# Altium schematic sheet 01.SchDoc
size 246 x 182 mm
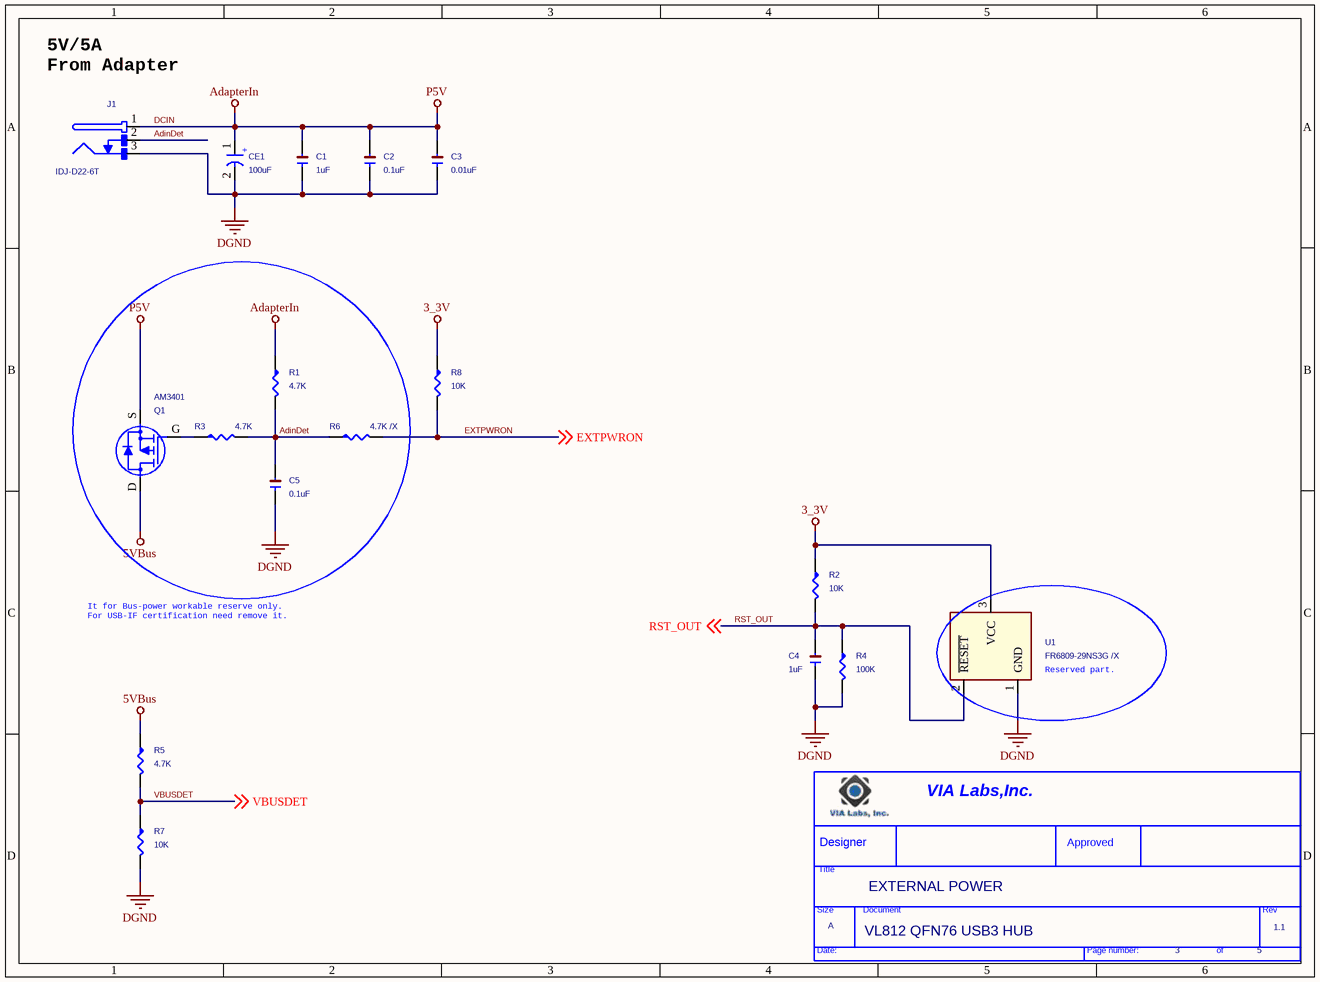
[diagram p0: 01.SchDoc]

## Parts
*  Page Count: 5  Page Number: 3  Page Size: A  Title: EXTERNAL POWER  RevCode: 1.1  Doc: VL812 QFN76 USB3 HUB  (hidden comment: TitleBlock0)  (graphical)
C1  1uF  [1206]
C2  0.1uF  [1206]
C3  0.01uF  [1206]
C4  1uF  [1206]
C5  0.1uF  [1206]
CE1  100uF  [EC5X7-80]
J1  IDJ-D22-6T  [DCJACK-IDJ-D22-6T]
Q1  AM3401  [sot23-gds]
R1  4.7K  [RES0402]
R2  10K  [RES0402]
R3  4.7K  [RES0402]
R4  100K  [RES0402]
R5  4.7K  [RES0402]
R6  4.7K /X  [RES0402]
R7  10K  [RES0402]
R8  10K  [RES0402]
U1  FR6809-29NS3G /X  [SOT23-132]

## Nets
3_3V: R2.1 R8.1 U1.3(VCC)
5VBus: Q1.D(DRAIN) R5.1
DCIN: C1.2 C2.2 C3.2 CE1.1(+) J1.1 Q1.S(SOURCE) R1.1  [also labelled AdapterIn, P5V]
DGND: C1.1 C2.1 C3.1 C4.1 C5.1 CE1.2(-) J1.3 R4.2 R7.2 U1.1(GND)
AdinDet: C5.2 J1.2 R1.2 R3.2 R6.1
EXTPWRON: R6.2 R8.2 ; off-sheet EXTPWRON
RST_OUT: C4.2 R2.2 R4.1 U1.2(~{RESET}) ; off-sheet RST_OUT
VBUSDET: R5.2 R7.1 ; off-sheet VBUSDET
NetQ1_G: Q1.G(GATE) R3.1

## Notes on the sheet
- (near J1) 5V/5A
  From Adapter
- It for Bus-power workable reserve only.
  For USB-IF certification need remove it.
- (near U1) Reserved part.
- (in symbol TitleBlock0) VIA Labs,Inc.; Designer; Approved; Title; Size; Document; Rev; Date:; Page number:; of

## Library data of the parts
C1 C4 = C: Part Number: 99G12-00009B; DSCX: CAP ML 1 uF Z 10V Y5V SMT0603,THICKNESS=0.80∮0.10mm C1608Y5V105ZDT DARFON; QUAN: 13000; Qualify: YES; Dsc8: DARFON; Dsc7: C1608Y5V105ZDT; Dsc6: SMT0603,THICKNESS=0.80∮0.10mm; Dsc5: Y5V; Dsc4: 10V; Dsc3: Z; Dsc1: CAP ML; approval status: A; 弧: CAP ML 1 uF Z 10V Y5V SMT0603,; ID: 17426; Date: 12302002; Cost: 0.00; Part Type: SMD CAP; Dsc2: 1 uF
C2 = C: Part Number: 99G12-006525; ID: 16,890; 弧: CAP ML0.1 uFZ16VY5VSMT0402,THICKNESS=0.50∮0.05mmCC; approval status: A; Dsc1: CAP ML; Dsc3: K; Dsc4: 16V; Dsc5: X5R; Dsc6: SMT0402,THICKNESS=0.50mm; Dsc7: EMK105BJ104KV; Dsc8: TAIYO; Qualify: YES; QUAN: 34,490; DSCX: CAP ML 0.1 uF K 16V X5R SMT0402,THICKNESS=0.50mm EMK105BJ104KV TAIYO; Date: 12302002; Dsc2: 0.1 uF; Part Type: SMD CAP; Cost: 0
C3 = C: Part Number: 99G12-005696; DSCX: CAP ML 0.01 uF Z 16V Y5V SMT0402,THICKNESS=0.50∮0.05mm CC0402ZRY5V7BB103 YAGEO; QUAN: 10000; Qualify: YES; Dsc8: YAGEO; Dsc7: CC0402ZRY5V7BB103; Dsc6: SMT0402,THICKNESS=0.50∮0.05mm; Dsc5: Y5V; Dsc4: 16V; Dsc3: Z; Dsc1: CAP ML; approval status: NA; 弧: CAP ML0.01 uFZ16VY5VSMT0402,THICKNESS=0.50∮0.05mmC; ID: 17869; Date: 12302002; Cost: 0.00; Part Type: SMD CAP; Dsc2: 0.01 uF
C5 = C: Part Number: 99G12-006525; QUAN: 34,490; Qualify: YES; Dsc8: TAIYO; Dsc7: EMK105BJ104KV; Dsc6: SMT0402,THICKNESS=0.50mm; Dsc5: X5R; Dsc4: 16V; Dsc3: K; Dsc1: CAP ML; approval status: A; 弧: CAP ML0.1 uFZ16VY5VSMT0402,THICKNESS=0.50∮0.05mmCC; ID: 16,890; DSCX: CAP ML 0.1 uF K 16V X5R SMT0402,THICKNESS=0.50mm EMK105BJ104KV TAIYO; Date: 12302002; Cost: 0; Part Type: SMD CAP; Dsc2: 0.1 uF
CE1 = CE: Part Number: 99G15-020132; ID: 18195; 弧: CAP EC 100 uF M 10V 105 DIP P; approval status: A; Dsc1: CAP EC; Dsc3: M; Dsc4: 10V; Dsc5: 105; Dsc6: DIP PIN 5*7*2mm,3.0~3.5mm; Dsc7: ECMI101M0100507EBC; Dsc8: GSC; Qualify: YES; Approval Sheet: \\tp_mi05\BackUp\VPSD\BillYang\VEPD\Data Sheet\99G\99G15-02\99G15-020132.pdf; QUAN: 3845; DSCX: CAP EC 100 uF M 10V 105 DIP PIN 5*7*2mm,3.0~3.5mm ECMI101M0100507EBC GSC; Date: 12302002; Dsc2: 100 uF; Part Type: DIP CAP EC; Cost: 0.01
J1 = DCJack-IDJ-D22-6T_0: Part Number: 99G30-110462; DSCX: CONN JACK DC JACK IDJ-D22-6T 3PIN BLACK 2.5mm DIP/RIGHT ANGLE 翬礨; QUAN: 0; Qualify: YES; Dsc8: 翬礨; Dsc7: DIP/RIGHT ANGLE; Dsc6: 2.5mm; Dsc5: BLACK; Dsc4: 3PIN; Dsc2: DC JACK; Dsc1: CONN JACK; approval status: PL; 弧: CONN JACK DC JACK IDJ-D22-6T 3; ID: 21,793; Date: 11082004; Cost: 0.22; Part Type: DIP CONN; Dsc3: IDJ-D22-6T
Q1 = APM2301AAC-TR_0: Part Number: 99G10-030249; ID: 14098; 弧: TRANSISTOR FET P CHANNEL APM23; approval status: CA; Dsc1: TRANSISTOR FET P CHANNEL; Dsc2: APM2301AAC-TRL; Dsc3: SOT23; Dsc4: 3PIN; Dsc8: ANPEC; Qualify: YES; QUAN: 17271; Date: 11072003; Part Type: SMD TRANSISTOR; Cost: 0.08
R1 R3 R5 R6 = R: Part Number: 99G19-001443; ID: 17,534; 弧: RES CHIP 4.7K OHM J 1/16W CF S; approval status: NA; Dsc1: RES CHIP; Dsc2: 4.7K OHM; Dsc3: J; Dsc4: 1/16W; Dsc5: CF; Dsc6: SMT0402,THICKNESS=0.35∮0.05mm; Dsc7: RC0402JR-074K7L; Dsc8: YAGEO; Qualify: YES; QUAN: 9,320; DSCX: RES CHIP 4.7K OHM J 1/16W CF SMT0402,THICKNESS=0.35∮0.05mm RC0402JR-074K7L YAGEO; Date: 12302002; Part Type: SMD RES; Cost: 0
R2 = R: Part Number: 99G19-001453; QUAN: 15,463; Qualify: YES; Dsc8: YAGEO; Dsc7: RC0402JR-0710KL; Dsc6: SMT0402,THICKNESS=0.35∮0.05mm; Dsc5: CF; Dsc4: 1/16W; Dsc3: J; Dsc2: 10K OHM; Dsc1: RES CHIP; approval status: NA; 弧: RES CHIP 10K OHM J 1/10W CF SM; ID: 17,537; DSCX: RES CHIP 10K OHM J 1/16W CF SMT0402,THICKNESS=0.35∮0.05mm RC0402JR-0710KL YAGEO; Date: 12302002; Cost: 0; Part Type: SMD RES
R4 = R: Part Number: 99G19-001633; QUAN: 108,216; Qualify: YES; Dsc8: YAGEO; Dsc7: RC0402JR-07100KL; Dsc6: SMT0402,THICKNESS=0.35∮0.05mm; Dsc5: CF; Dsc4: 1/16W; Dsc3: J; Dsc2: 100K OHM; Dsc1: RES CHIP; approval status: PL; 弧: RES CHIP 100K OHM J 1/10W CF S; ID: 17,576; DSCX: RES CHIP 100K OHM J 1/16W CF SMT0402,THICKNESS=0.35∮0.05mm RC0402JR-07100KL YAGEO; Date: 12302002; Cost: 0; Part Type: SMD RES
R7 R8 = R: Part Number: 99G19-001453; ID: 17,537; 弧: RES CHIP 10K OHM J 1/10W CF SM; approval status: NA; Dsc1: RES CHIP; Dsc2: 10K OHM; Dsc3: J; Dsc4: 1/16W; Dsc5: CF; Dsc6: SMT0402,THICKNESS=0.35∮0.05mm; Dsc7: RC0402JR-0710KL; Dsc8: YAGEO; Qualify: YES; QUAN: 15,463; DSCX: RES CHIP 10K OHM J 1/16W CF SMT0402,THICKNESS=0.35∮0.05mm RC0402JR-0710KL YAGEO; Date: 12302002; Part Type: SMD RES; Cost: 0
U1 = BAT54C/SOT_0
* = TitleBlock0: Page Create Date: March  8, 1995